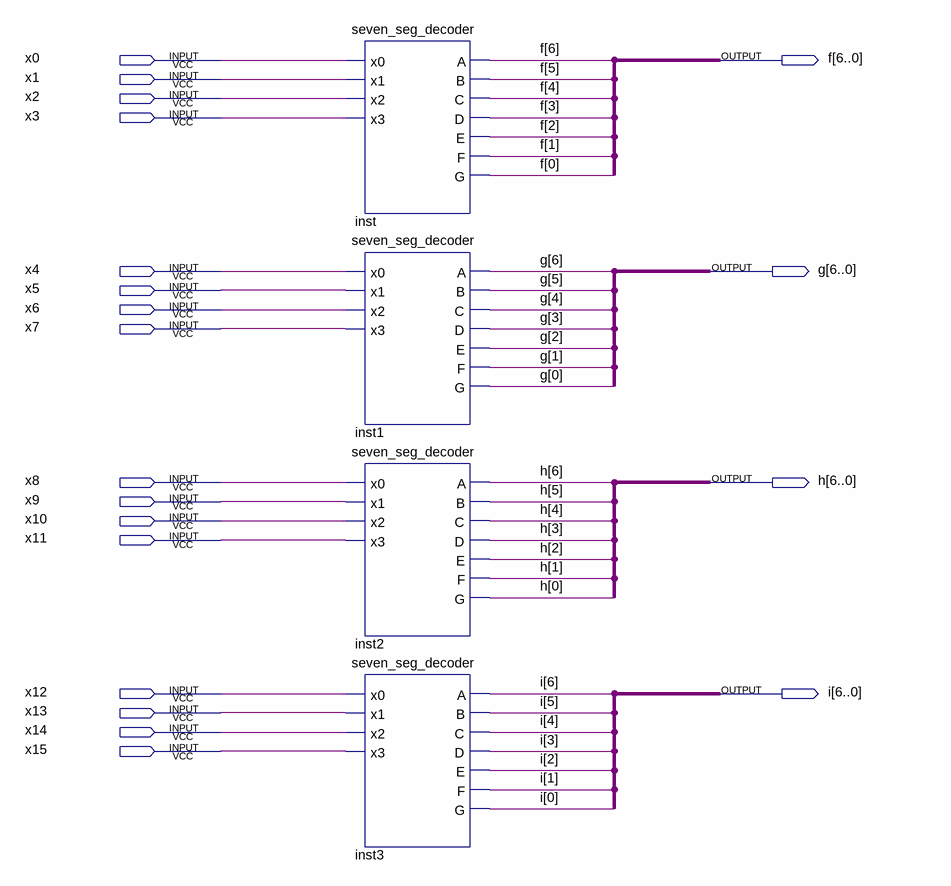
[diagram p0: schematic sheet]
// Quartus schematic lab5step1.bdf as structural Verilog: 4 symbols, 20 pins
module lab5step1 (
  input  x0,
  input  x1,
  input  x2,
  input  x3,
  input  x4,
  input  x5,
  input  x6,
  input  x7,
  input  x8,
  input  x9,
  input  x10,
  input  x11,
  input  x12,
  input  x13,
  input  x14,
  input  x15,
  output [6:0] f,
  output [6:0] g,
  output [6:0] h,
  output [6:0] i
);

  seven_seg_decoder inst (
    .x0(x0), .x1(x1), .x2(x2), .x3(x3), .A(f[6]), .B(f[5]), .C(f[4]), .D(f[3]), .E(f[2]), .F(f[1]), .G(f[0]));
  seven_seg_decoder inst1 (
    .x0(x4), .x1(x5), .x2(x6), .x3(x7), .A(g[6]), .B(g[5]), .C(g[4]), .D(g[3]), .E(g[2]), .F(g[1]), .G(g[0]));
  seven_seg_decoder inst2 (
    .x0(x8), .x1(x9), .x2(x10), .x3(x11), .A(h[6]), .B(h[5]), .C(h[4]), .D(h[3]), .E(h[2]), .F(h[1]), .G(h[0]));
  seven_seg_decoder inst3 (
    .x0(x12), .x1(x13), .x2(x14), .x3(x15), .A(i[6]), .B(i[5]), .C(i[4]), .D(i[3]), .E(i[2]), .F(i[1]),
    .G(i[0]));
endmodule
